# Altium schematic sheet MCU.SchDoc
size 420 x 297 mm; Organization: Altium Limited; Address1: L3, 12a Rodborough Rd; Address2: Frenchs Forest; Address3: NSW; Address4: Australia 2086; SheetNumber: 2; SheetTotal: 4
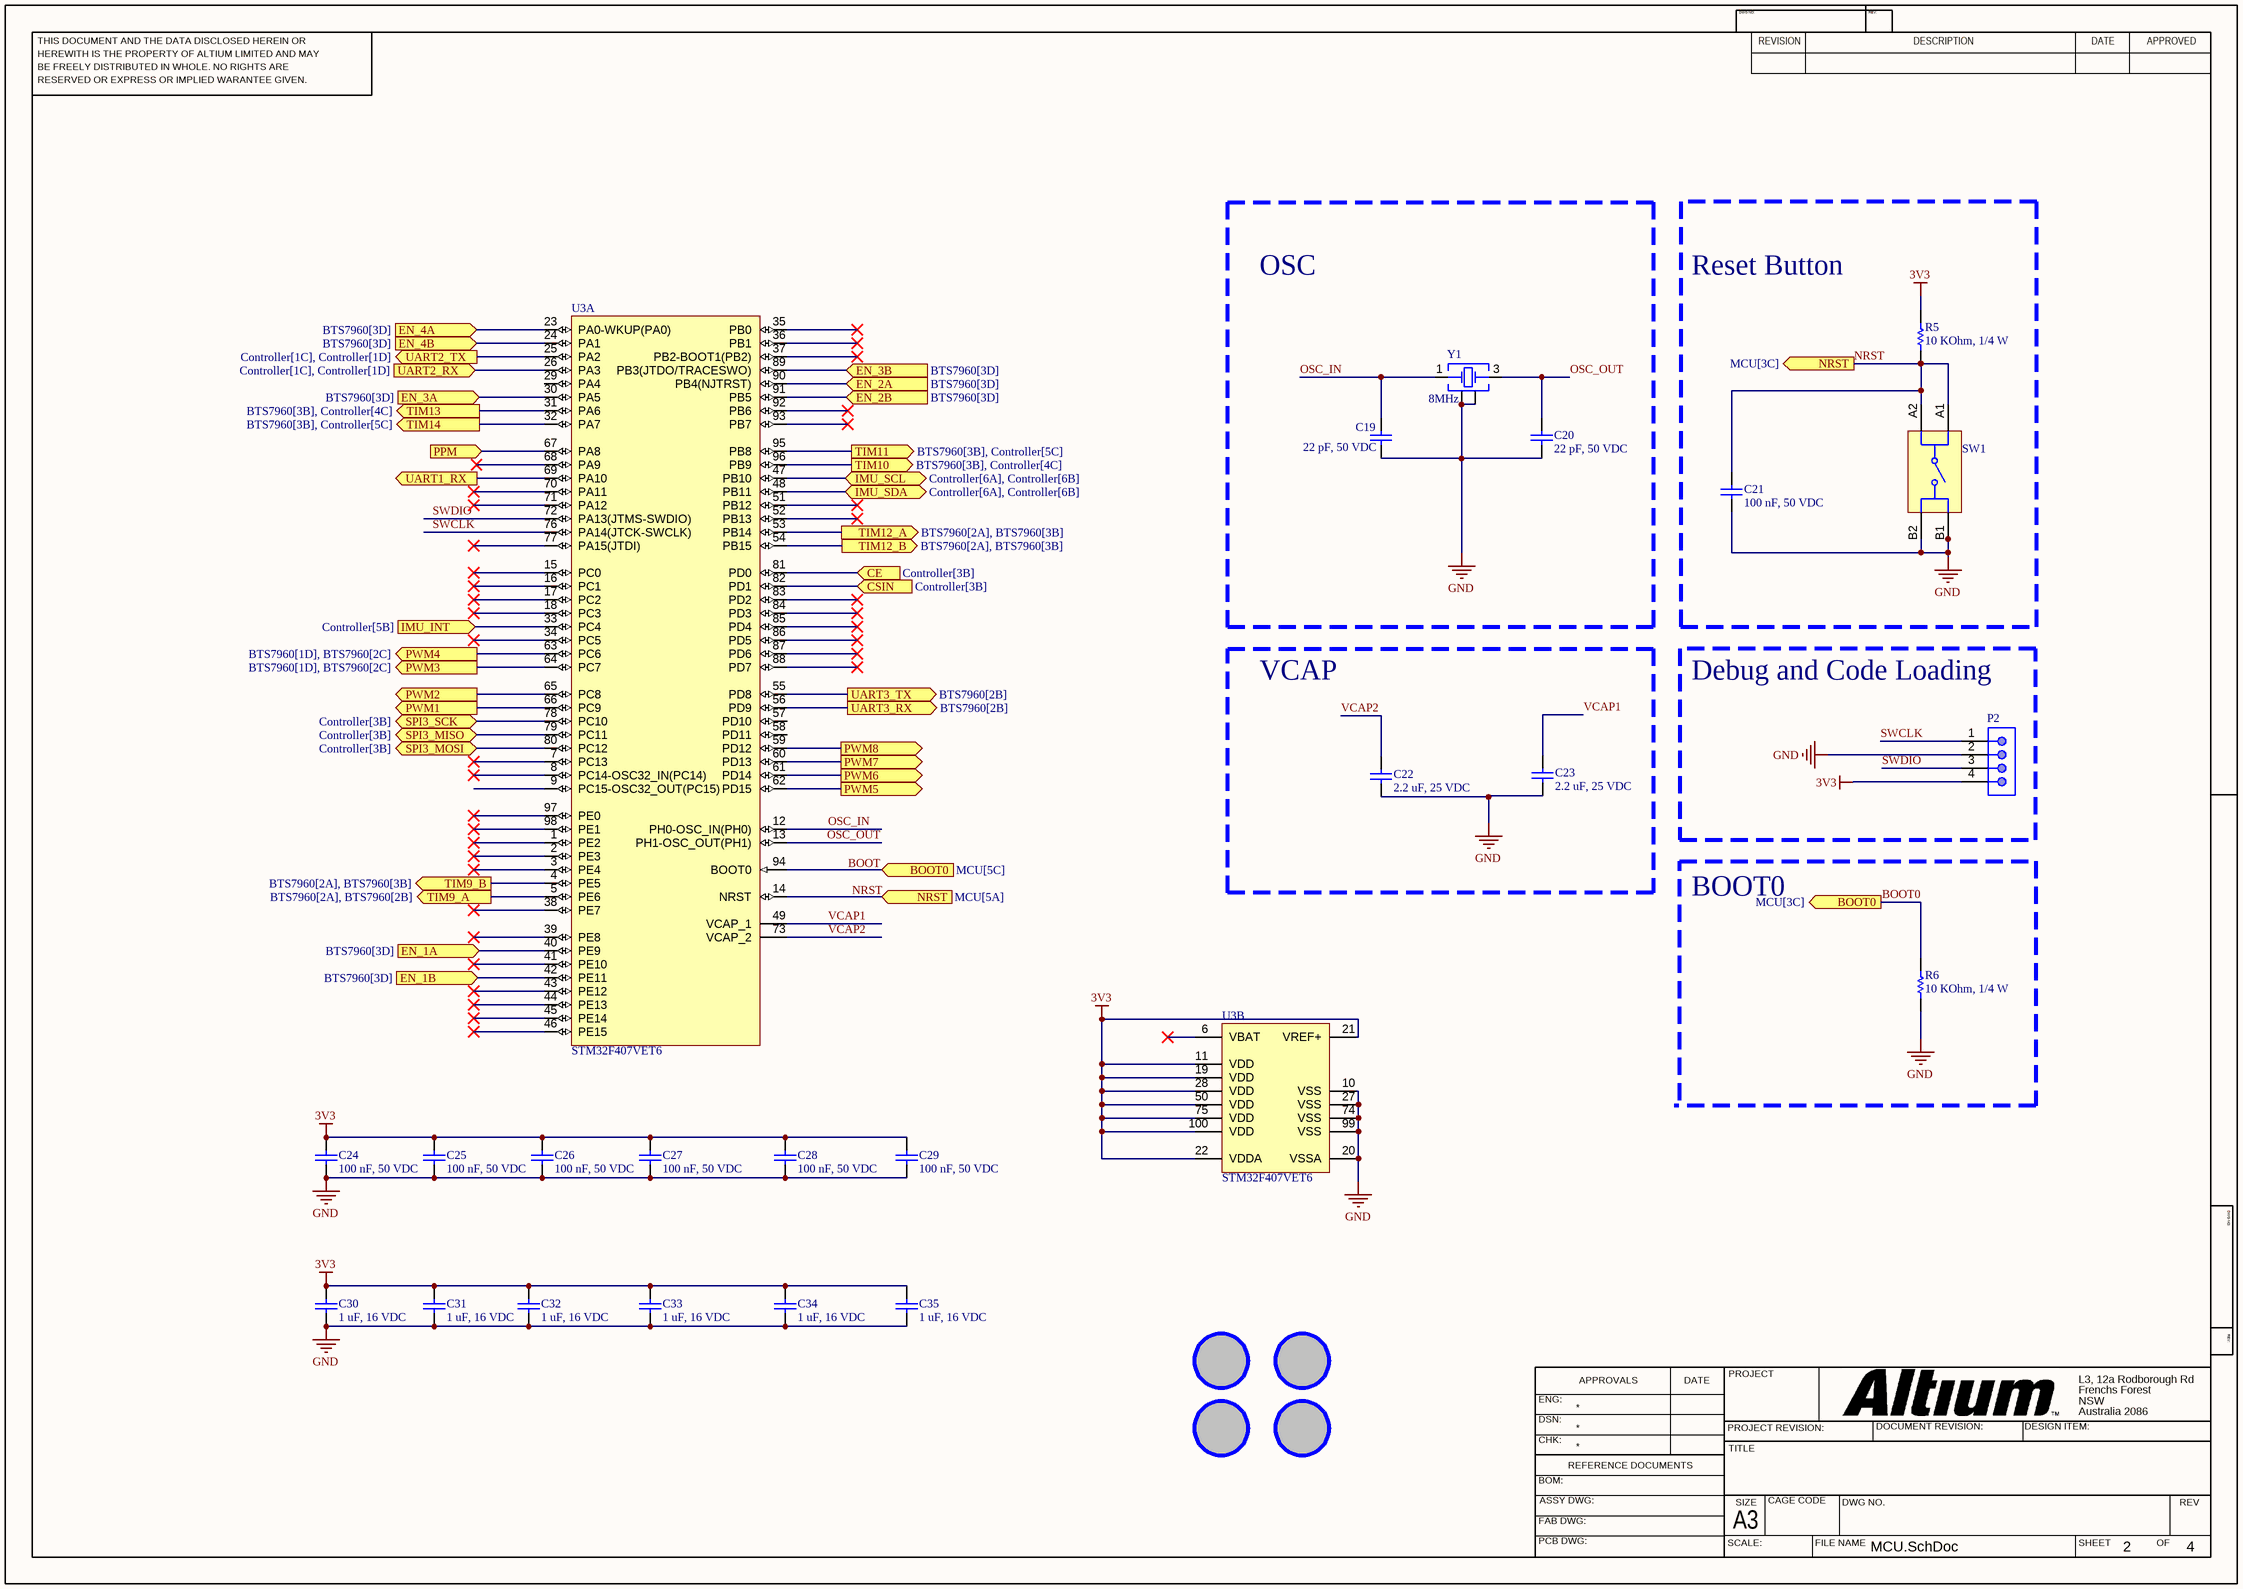
[diagram p0: MCU.SchDoc]

## Parts
(Parts that share a designator on the sheet are numbered #1, #2 ... from top to bottom, then left to right.)
?#1  Hole  [VIA]  (value not drawn)
?#2  Hole  [VIA]  (value not drawn)
?#3  Hole  [VIA]  (value not drawn)
?#4  Hole  [VIA]  (value not drawn)
C19  22 pF, 50 VDC  [CAP_0603]
C20  22 pF, 50 VDC  [CAP_0603]
C21  100 nF, 50 VDC  [CAP_0603]
C22  2.2 uF, 25 VDC  [CAP_0805]
C23  2.2 uF, 25 VDC  [CAP_0805]
C24  100 nF, 50 VDC  [CAP_0805]
C25  100 nF, 50 VDC  [CAP_0805]
C26  100 nF, 50 VDC  [CAP_0805]
C27  100 nF, 50 VDC  [CAP_0805]
C28  100 nF, 50 VDC  [CAP_0805]
C29  100 nF, 50 VDC  [CAP_0805]
C30  1 uF, 16 VDC  [CAP_0805]
C31  1 uF, 16 VDC  [CAP_0805]
C32  1 uF, 16 VDC  [CAP_0805]
C33  1 uF, 16 VDC  [CAP_0805]
C34  1 uF, 16 VDC  [CAP_0805]
C35  1 uF, 16 VDC  [CAP_0805]
P2  61300411121  [61300411121]  (value not drawn)
R5  10 KOhm, 1/4 W  [resistor_0603]
R6  10 KOhm, 1/4 W  [resistor_0603]
SW1  430181038816  [WS-TASV_L4.5W4.5H3.8_430181038816]  (value not drawn)
U3  STM32F407VET6  [STM-LQFP100_V]  (parts A,B of 2)
Y1  8MHz  [WE-XTAL_CFPX-180]

## Blocks framed on the sheet
OSC: C19 C20 Y1
Reset Button: C21 R5 SW1
VCAP: C22 C23
Debug and Code Loading: P2

## Ports
BOOT0 (in, see MCU[5C]), BOOT0 (out, see MCU[3C]), CE (in, see Controller[3B]), CSIN (in, see Controller[3B]), EN_1A (in, see BTS7960[3D]), EN_1B (in, see BTS7960[3D]), EN_2A (in, see BTS7960[3D]), EN_2B (in, see BTS7960[3D]), EN_3A (in, see BTS7960[3D]), EN_3B (in, see BTS7960[3D]), EN_4A (in, see BTS7960[3D]), EN_4B (in, see BTS7960[3D]), IMU_INT (in, see Controller[5B]), IMU_SCL (bidir, see Controller[6A], Controller[6B]), IMU_SDA (bidir, see Controller[6A], Controller[6B]), NRST (in, see MCU[5A]), NRST (out, see MCU[3C]), PPM (in, see Controller[2B]), PWM1 (out, see BTS7960[1C], BTS7960[2C]), PWM2 (out, see BTS7960[1C], BTS7960[2C]), PWM3 (out, see BTS7960[1D], BTS7960[2C]), PWM4 (out, see BTS7960[1D], BTS7960[2C]), PWM5 (out, see BTS7960[1D], BTS7960[2C]), PWM6 (out, see BTS7960[1D], BTS7960[2C]), PWM7 (out, see BTS7960[1D], BTS7960[2C]), PWM8 (out, see BTS7960[1D], BTS7960[2C]), SPI3_MISO (bidir, see Controller[3B]), SPI3_MOSI (bidir, see Controller[3B]), SPI3_SCK (bidir, see Controller[3B]), TIM9_A (out, see BTS7960[2A], BTS7960[2B]), TIM9_B (out, see BTS7960[2A], BTS7960[3B]), TIM10 (out, see BTS7960[3B], Controller[4C]), TIM11 (out, see BTS7960[3B], Controller[5C]), TIM12_A (out, see BTS7960[2A], BTS7960[3B]), TIM12_B (out, see BTS7960[2A], BTS7960[3B]), TIM13 (out, see BTS7960[3B], Controller[4C]), TIM14 (out, see BTS7960[3B], Controller[5C]), UART1_RX (out, see Controller[2A]), UART2_RX (in, see Controller[1C], Controller[1D]), UART2_TX (out, see Controller[1C], Controller[1D]), UART3_RX (out, see BTS7960[2B]), UART3_TX (out, see BTS7960[2B])

## Nets
3V3: C24.2 C25.2 C26.2 C27.2 C28.2 C29.2 C30.2 C31.2 C32.2 C33.2 C34.2 C35.2 P2.4 R5.2 U3.11(VDD) U3.19(VDD) U3.21(VREF+) U3.22(VDDA) U3.28(VDD) U3.50(VDD) U3.75(VDD) U3.100(VDD)
GND: C19.1 C20.1 C21.2 C22.1 C23.1 C24.1 C25.1 C26.1 C27.1 C28.1 C29.1 C30.1 C31.1 C32.1 C33.1 C34.1 C35.1 P2.2 R6.1 SW1.B1 SW1.B2 U3.10(VSS) U3.20(VSSA) U3.27(VSS) U3.74(VSS) U3.99(VSS) Y1.2(GND) Y1.4(GND)
BOOT0: R6.2 U3.94(BOOT0) ; port BOOT0
CE: U3.81(PD0) ; port CE
CSIN: U3.82(PD1) ; port CSIN
EN_1A: U3.40(PE9) ; port EN_1A
EN_1B: U3.42(PE11) ; port EN_1B
EN_2A: U3.90(PB4(NJTRST)) ; port EN_2A
EN_2B: U3.91(PB5) ; port EN_2B
EN_3A: U3.30(PA5) ; port EN_3A
EN_3B: U3.89(PB3(JTDO/TRACESWO)) ; port EN_3B
EN_4A: U3.23(PA0-WKUP(PA0)) ; port EN_4A
EN_4B: U3.24(PA1) ; port EN_4B
IMU_INT: U3.33(PC4) ; port IMU_INT
IMU_SCL: U3.47(PB10) ; port IMU_SCL
IMU_SDA: U3.48(PB11) ; port IMU_SDA
NRST: C21.1 R5.1 SW1.A1 SW1.A2 U3.14(NRST) ; port NRST
OSC_IN: C19.2 U3.12(PH0-OSC_IN(PH0)) Y1.1(Crystal)
OSC_OUT: C20.2 U3.13(PH1-OSC_OUT(PH1)) Y1.3(Crystal)
PPM: U3.67(PA8) ; port PPM
PWM1: U3.66(PC9) ; port PWM1
PWM2: U3.65(PC8) ; port PWM2
PWM3: U3.64(PC7) ; port PWM3
PWM4: U3.63(PC6) ; port PWM4
PWM5: U3.62(PD15) ; port PWM5
PWM6: U3.61(PD14) ; port PWM6
PWM7: U3.60(PD13) ; port PWM7
PWM8: U3.59(PD12) ; port PWM8
SPI3_MISO: U3.79(PC11) ; port SPI3_MISO
SPI3_MOSI: U3.80(PC12) ; port SPI3_MOSI
SPI3_SCK: U3.78(PC10) ; port SPI3_SCK
SWCLK: P2.1 U3.76(PA14(JTCK-SWCLK))
SWDIO: P2.3 U3.72(PA13(JTMS-SWDIO))
TIM9_A: U3.5(PE6) ; port TIM9_A
TIM9_B: U3.4(PE5) ; port TIM9_B
TIM10: U3.96(PB9) ; port TIM10
TIM11: U3.95(PB8) ; port TIM11
TIM12_A: U3.53(PB14) ; port TIM12_A
TIM12_B: U3.54(PB15) ; port TIM12_B
TIM13: U3.31(PA6) ; port TIM13
TIM14: U3.32(PA7) ; port TIM14
UART1_RX: U3.69(PA10) ; port UART1_RX
UART2_RX: U3.26(PA3) ; port UART2_RX
UART2_TX: U3.25(PA2) ; port UART2_TX
UART3_RX: U3.56(PD9) ; port UART3_RX
UART3_TX: U3.55(PD8) ; port UART3_TX
VCAP1: C23.2 U3.49(VCAP_1)
VCAP2: C22.2 U3.73(VCAP_2)

Not connected (* = marked no-connect by the designer): ?#1 1; ?#2 1; ?#3 1; ?#4 1; U3 1(PE2)* 2(PE3)* 3(PE4)* 6(VBAT)* 7(PC13)* 8(PC14-OSC32_IN(PC14))* 9(PC15-OSC32_OUT(PC15)) 15(PC0)* 16(PC1)* 17(PC2)* 18(PC3)* 29(PA4) 34(PC5)* 35(PB0)* 36(PB1)* 37(PB2-BOOT1(PB2))* 38(PE7)* 39(PE8)* 41(PE10)* 43(PE12)* 44(PE13)* 45(PE14)* 46(PE15)* 51(PB12)* 52(PB13)* 57(PD10) 58(PD11) 68(PA9)* 70(PA11)* 71(PA12)* 77(PA15(JTDI))* 83(PD2)* 84(PD3)* 85(PD4)* 86(PD5)* 87(PD6)* 88(PD7)* 92(PB6)* 93(PB7)* 97(PE0)* 98(PE1)*

## Notes on the sheet
- BOOT0
- Labels drawn without touching a wire or pin: BOOT, NRST
- THIS DOCUMENT AND THE DATA DISCLOSED HEREIN OR
- HEREWITH IS THE PROPERTY OF ALTIUM LIMITED AND MAY
- DWG NO:
- REVISION
- REV:
- DESCRIPTION
- DATE
- APPROVED
- BE FREELY DISTRIBUTED IN WHOLE. NO RIGHTS ARE
- RESERVED OR EXPRESS OR IMPLIED WARANTEE GIVEN.
- ENG:
- APPROVALS
- PROJECT
- DSN:
- CHK:
- REFERENCE DOCUMENTS
- PROJECT REVISION:
- TITLE
- DOCUMENT REVISION:
- DESIGN ITEM:
- BOM:
- FAB DWG:
- PCB DWG:
- ASSY DWG:
- SCALE:
- A3
- SIZE
- CAGE CODE
- FILE NAME
- DWG NO.
- SHEET
- OF
- REV

## Library data of the parts
?#1-?#4 = Hole: Hole 3mm
C19 C20 = 0106032200550: CAP, size 0603, 22 pF, 50 VDC; Manufacture Name: TDK; Manufacture SN: CGA3E2NP01H220J080AA; Capacitance: 22 pF; Tolerance: +/-5%; Voltage Rating DC: 50 VDC; ComponentLink2Description: Datasheet; ComponentLink2URL: https://product.tdk.com/system/files/dam/doc/product/capacitor/ceramic/mlcc/catalog/mlcc_automotive_hightemp_en.pdf?ref_disty=mouser; Operating Temperature: -55 to +125degC; Packaging: Tape and Reel; Mounting Technology: SMT; Size: 0603; Supplier 1 Name: Mouser; Supplier 1 SN: 810-CGA3E2NP01H220JA; Supplier 1 URL: https://www.mouser.com/ProductDetail/TDK/CGA3E2NP01H220J080AA?qs=xLDY6iXSiQbIDiPJq57tVA%3D%3D&utm_source=mouser-refine-download&utm_medium=file&utm_campaign=CGA3E2NP01H220J080AA&utm_content=TDK; Supplier 2 Name: Digi-Key; Supplier 2 SN: 445-12401-2-ND; Supplier 2 URL: https://www.digikey.com/en/products/detail/tdk-corporation/cga3e2np01h220j080aa/3949637; Supplier 3 Name: thegioiic; Supplier 3 SN: N/A; Supplier 3 URL: N/A; Value: 22 pF, 50 VDC
C21 = 0106031041050: CAP, size 0603, 100 nF, 50 VDC; Manufacture Name: TDK; Manufacture SN: CGA3E3X8R1H104K080AE; Capacitance: 100 nF; Tolerance: +/-10%; Voltage Rating DC: 50 VDC; ComponentLink2Description: Datasheet; ComponentLink2URL: https://product.tdk.com/system/files/dam/doc/product/capacitor/ceramic/mlcc/catalog/mlcc_automotive_soft_en.pdf?ref_disty=mouser; Operating Temperature: -55 to +125degC; Packaging: Tape and Reel; Mounting Technology: SMT; Size: 0603; Supplier 1 Name: Mouser; Supplier 1 SN: 810-CGA3E3X8R1H104KA; Supplier 1 URL: https://www.mouser.com/ProductDetail/TDK/CGA3E3X8R1H104K080AE?qs=nQSIdc08i%252Bd8g3IRRgU2bw%3D%3D&utm_source=mouser-refine-download&utm_medium=file&utm_campaign=CGA3E3X8R1H104K080AE&utm_content=TDK; Supplier 2 Name: Digi-Key; Supplier 2 SN: 445-173697-2-ND; Supplier 2 URL: https://www.digikey.com/en/products/detail/tdk-corporation/cga3e3x8r1h104k080ae/5809262; Supplier 3 Name: thegioiic; Supplier 3 SN: N/A; Supplier 3 URL: N/A; Value: 100 nF, 50 VDC
C22 C23 = 0108052251025: CAP, size 0805, 2.2 uF, 25 VDC; Manufacture Name: TDK; Manufacture SN: CGA4J3X7R1E225K125AD; Capacitance: 2.2 uF; Tolerance: +/-10%; Voltage Rating DC: 25 VDC; ComponentLink2Description: Datasheet; ComponentLink2URL: https://product.tdk.com/system/files/dam/doc/product/capacitor/ceramic/mlcc/catalog/mlcc_automotive_epoxy_en.pdf?ref_disty=mouser; Operating Temperature: -55 to +125degC; Packaging: Tape and Reel; Mounting Technology: SMT; Size: 0805; Supplier 1 Name: Mouser; Supplier 1 SN: 810-CGA4J3X7R1E225KD; Supplier 1 URL: https://www.mouser.vn/ProductDetail/TDK/CGA4J3X7R1E225K125AD?qs=xLDY6iXSiQZ6drRfaPQTzQ%3D%3D&utm_source=mouser-refine-download&utm_medium=file&utm_campaign=CGA4J3X7R1E225K125AD&utm_content=TDK; Supplier 2 Name: Digi-Key; Supplier 2 SN: 445-9923-2-ND; Supplier 2 URL: https://www.digikey.com/en/products/detail/tdk-corporation/cga4j3x7r1e225k125ad/3933656; Supplier 3 Name: thegioiic; Supplier 3 SN: OEM; Supplier 3 URL: N/A; Value: 2.2 uF, 25 VDC
C24-C29 = 0108051031050: CAP, size 0805, 100 nF, 50 VDC; Manufacture Name: TDK; Manufacture SN: CGA4C2C0G1H103J060AA; Capacitance: 10 nF; Tolerance: +/-5%; Voltage Rating DC: 50 VDC; Value: 10 nF, 50 VDC; ComponentLink2Description: Datasheet; ComponentLink2URL: https://product.tdk.com/system/files/dam/doc/product/capacitor/ceramic/mlcc/catalog/mlcc_automotive_general_en.pdf?ref_disty=mouser; Operating Temperature: -55 to +125degC; Packaging: Tape and Reel; Mounting Technology: SMT; Size: 0805; Supplier 1 Name: Mouser; Supplier 1 SN: 810-CGA4C2C0G1H103J; Supplier 1 URL: https://www.mouser.vn/ProductDetail/TDK/CGA4C2C0G1H103J060AA?qs=FxQuwy19cyC9M6v0nMqjhA%3D%3D&utm_source=mouser-refine-download&utm_medium=file&utm_campaign=CGA4C2C0G1H103J060AA&utm_content=TDK; Supplier 2 Name: Digi-Key; Supplier 2 SN: 445-6947-2-ND; Supplier 2 URL: https://www.digikey.com/en/products/detail/tdk-corporation/cga4c2c0g1h103j060aa/2672840; Supplier 3 Name: thegioiic; Supplier 3 SN: OEM; Supplier 3 URL: N/A
C30-C35 = 0108051051016: CAP, size 0805, 1 uF, 16 VDC; Manufacture Name: TDK; Manufacture SN: CGA4J2X7R1C105K125AA; Capacitance: 1 uF; Tolerance: +/-10%; Voltage Rating DC: 16 VDC; ComponentLink2Description: Datasheet; ComponentLink2URL: https://product.tdk.com/system/files/dam/doc/product/capacitor/ceramic/mlcc/catalog/mlcc_automotive_general_en.pdf?ref_disty=mouser; Operating Temperature: -55 to +125degC; Packaging: Tape and Reel; Mounting Technology: SMT; Size: 0805; Supplier 1 Name: Mouser; Supplier 1 SN: 810-CGA4J2X7R1C105K; Supplier 1 URL: https://www.mouser.vn/ProductDetail/TDK/CGA4J2X7R1C105K125AA?qs=NRhsANhppD8sFjo%252B1TQuCQ%3D%3D&utm_source=mouser-refine-download&utm_medium=file&utm_campaign=CGA4J2X7R1C105K125AA&utm_content=TDK; Supplier 2 Name: Digi-Key; Supplier 2 SN: 445-5689-2-ND; Supplier 2 URL: https://www.digikey.com/en/products/detail/tdk-corporation/cga4j2x7r1c105k125aa/2443167; Supplier 3 Name: thegioiic; Supplier 3 SN: OEM; Supplier 3 URL: N/A; Value: 1 uF, 16 VDC
P2 = 61300411121: WR-PHD Pin Header, THT, pitch 2.54mm, Single Row, Vertical, 4p; Manufacturer: Wurth Elektronik; Pin Number: 4; Rated Current: 3A; Working Voltage: 250VAC; Withstanding Voltage: 500VAC; Contact Resistance: 20mOhm; Supply Name 1: Mouser; ComponentLink1Description: Manufacturer; ComponentLink1URL: http://www.we-online.de; ComponentLink2Description: Datasheet; ComponentLink2URL: https://www.we-online.com/catalog/datasheet/61300411121.pdf; Manufacturer Part Number: 61300411121; Published Date: May 2020; Pitch: 2.54mm; Operating Temperature: -40 to +105degC; Mounting Technology: THT; Packaging: Bag; Gender: Pin Header; Row Number: Single; Orientation: Vertical; ComponentLink3Description: Global Supply; ComponentLink3URL: https://www.we-online.com/en/components/products/PHD_2_54_THT_PIN_HEADER_6130XX11121?sq=61300411121#61300411121; ComponentLink4Description: Global Supply; ComponentLink4URL: https://www.mouser.vn/ProductDetail/Wurth-Elektronik/61300411121?qs=PhR8RmCirEYQcLLqXD8rAA%3D%3D; Supplier 1 Name: Mouser; Supplier 1 SN: 710-61300311121; Supplier 1 URL: https://www.mouser.vn/ProductDetail/Wurth-Elektronik/61300311121?qs=PhR8RmCirEYxRWFJzNKsUw%3D%3D; Supplier 2 Name: Digi-Key; Supplier 2 SN: N/A; Supplier 2 URL: N/A; Supplier 3 Name: thegioiic; Supplier 3 SN: N/A; Supplier 3 URL: N/A
R5 R6 = 0006031031: RES, size 0603, 10 KOhm, 1/4 W; Manufacture  Name: OEM; Resistance: 10 KOhm; Rated Power: 1/4 W; Resistance Tolerance: +/-1%; Size: 0603; Mounting Technology: SMT; Supplier 1 Name: Mouser; Supplier 1 SN: 755-ESR03EZPF1002; Supplier 2 Name: Digi-Key; Supplier 2 SN: RHM10KADTR-ND RHM10KADCT-ND RHM10KADDKR-ND; Supplier 1 URL: https://www.mouser.vn/ProductDetail/ROHM-Semiconductor/ESR03EZPF1002?qs=sGAEpiMZZMvdGkrng054t67Efho1F8r6CDeAsqwFse8%3D; Supplier 3 Name: thegioiic; Supplier 3 SN: N/A; Supplier 3 URL: N/A; Manufacture  SN: OEM; Value: 10 KOhm, 1/4 W; ComponentLink1Description: Datasheet link; ComponentLink1URL: https://fscdn.rohm.com/en/products/databook/datasheet/passive/resistor/chip_resistor/esr-e.pdf; ComponentLink2Description: Supplier 1 URL; ComponentLink2URL: N/A; ComponentLink3Description: Supplier 2 URL; ComponentLink3URL: https://www.digikey.com/en/products/detail/rohm-semiconductor/ESR03EZPF1002/1983429; ComponentLink4Description: Supplier 3 URL; ComponentLink4URL: N/A; Supplier 2 URL: https://www.digikey.com/en/products/detail/rohm-semiconductor/ESR03EZPF1002/1983429
SW1 = 430181038816: WS-TASV SMT Tact Switch, L4.5 x W4.5 x H3.8mm, 160g, SPST-NO, 12V, 50mA; Manufacturer: Wurth Elektronik; Washable: No; Rated Voltage: 12VDC; Manufacturer Part Number: 430181038816; Category: Tact Switches; Match Code: WS-TASV; ComponentLink2Description: Datasheet Link; ComponentLink2URL: https://www.we-online.com/redexpert/spec/430181038816?ad; Mount: Surface Mount; Operating Temperature Max: 85°C; Operating Temperature Min: -40°C; Packaging: Tape and Reel; Length: 4.5mm; Width: 4.5mm; Height: 3.8mm; Circuit: SPST-NO; Contact Material: Stainless Steel; Operation Force: 160g; Rated Current: 50mA; Terminal Material: Copper Alloy; Terminal Plating: Silver; Supplier 1 Name: Mouser; Supplier 1 SN: 710-430181038816; Supplier 1 URL: https://www.mouser.vn/ProductDetail/Wurth-Elektronik/430181038816?qs=wr8lucFkNMWIANaPOquJXg%3D%3D; Supplier 2 Name: Digi-Key; Supplier 2 SN: 732-7003-2-ND; Supplier 2 URL: https://www.digikey.com/en/products/detail/w%C3%BCrth-elektronik/430181038816/5209016?s=N4IgTCBcDaICwGYAMBGAHCpC0YGwgF0BfIA; Supplier 3 Name: Thegioiic; Supplier 3 SN: N/A; Supplier 3 URL: https://www.thegioiic.com/nut-nhan-4-5x4-5mm-cao-3-8mm-4-chan-smd
U3 = CMP-0243-00016-3: ARM Cortex-M4 32-bit MCU+FPU, 210 DMIPS, 512 kB Flash, 192 kB Internal RAM, 82 I/Os, 100-pin LQFP, -40 to 85 degC, Tray; Manufacturer: STMicroelectronics; Supply Voltage(Vcc) max (V): 3.6; Supply Voltage(Vcc) min (V): 1.8; I/Os (High Current): 82; FLASH Size (Prog) (kB): 512; Operating Frequency(F) (Processor speed) (MHz): 168; D/A Converter: 2x12-bit; Internal RAM Size (kB): 192; PackageReference: LQFP100; Core: ARM Cortex-M4; ComponentLink1URL: http://www.st.com/web/en/home.html; ComponentLink1Description: Manufacturer URL; DatasheetVersion: Rev. 4; Packing: Tray; Mounting Technology: Surface Mount; ComponentLink2Description: Datasheet; ComponentLink2URL: http://www.st.com/st-web-ui/static/active/en/resource/technical/document/datasheet/DM00037051.pdf; ComponentLink3Description: Package Specification; PartNumber: STM32F407VET6; PackageVersion: Rev. 1, 06/2013; PackageDescription: 100-Pin Low Profile Quad Flat Package, 14 x 14 mm Body, 0.5 mm Pitch; ComponentLink3URL: http://www.st.com/st-web-ui/static/active/en/resource/technical/document/data_brief/DM00071938.pdf
Y1 = 073525126010: WE-XTAL Quartz Crystal, SMT, CFPX-180, 12MHz, +/-30ppm; Manufacturer Part Number: NX3225SA-12MHZ-STD-CSR-6; Manufacturer: NDK; Frequency Stability: +/-25ppm; Load Capacitance: 8pF; Frequency Tolerance: +/-15ppm; ComponentLink2Description: Supplier 1 URL; ComponentLink2URL: https://www.mouser.com/ProductDetail/NDK/NX3225SA-12MHZ-STD-CSR-6?qs=55YtniHzbhCh3aOy4zgUJQ%3D%3D; Operating Temperature: -20 to +70degC; Size: CFPX-104/5032; Frequency: 12MHz; Mounting Technology: SMT; Supplier 3 Name: thegioiic; Supplier 3 SN: N/A; Supplier 3 URL: https://www.thegioiic.com/thach-anh-12mhz-5032-4-chan-smd; ComponentLink1Description: Datasheet link; ComponentLink1URL: https://www.mouser.com/datasheet/2/905/c_NX3225SA_e-1317523.pdf; ComponentLink3Description: Supplier 2 URL; ComponentLink3URL: https://www.digikey.com/en/products/detail/ndk-america-inc/NX3225SA-12MHZ-STD-CSR-6/3125639; ComponentLink4Description: Supplier 3 URL; ComponentLink4URL: https://www.thegioiic.com/thach-anh-12mhz-5032-4-chan-smd; Supplier 1 Name: Mouser; Supplier 1 SN: 344-NX3225SA12MCSR6; Supplier 1 URL: https://www.mouser.com/ProductDetail/NDK/NX3225SA-12MHZ-STD-CSR-6?qs=55YtniHzbhCh3aOy4zgUJQ%3D%3D; Supplier 2 Name: Digi-Key; Supplier 2 SN: 644-1180-2-ND; Supplier 2 URL: https://www.digikey.com/en/products/detail/ndk-america-inc/NX3225SA-12MHZ-STD-CSR-6/3125639; Value: 12MHz